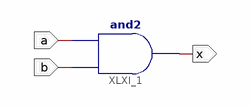
[diagram p0: schematic sheet 1]
// Xilinx ISE schematic andgate.sch (spartan3) as structural Verilog: 1 symbols, 3 ports
module andgate (
  input  a,
  input  b,
  output x
);

  and XLXI_1 (x, b, a);
endmodule
